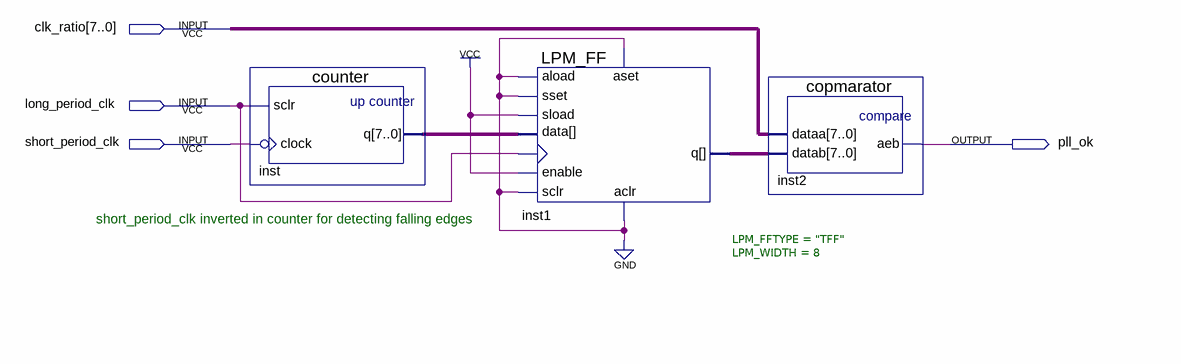
[diagram p0: schematic sheet]
// Quartus schematic PLL_TEST.bdf as structural Verilog: 3 symbols, 4 pins
module PLL_TEST (
  input  [7:0] clk_ratio,
  input  long_period_clk,
  input  short_period_clk,
  output pll_ok
);

  wire [7:0] inst1_q, inst_q;

  counter inst (.clock(~short_period_clk), .sclr(long_period_clk), .q(inst_q));
  LPM_FF #(.LPM_FFTYPE("TFF"), .LPM_WIDTH(8)) inst1 (
    .enable(1'b1), .clock(long_period_clk), .aload(1'b0), .sset(1'b0), .sload(1'b1), .aset(1'b0),
    .sclr(1'b0), .aclr(1'b0), .data(inst_q), .q(inst1_q));
  copmarator inst2 (.dataa(clk_ratio), .datab(inst1_q), .aeb(pll_ok));

  // Notes on the sheet:
  //   short_period_clk inverted in counter for detecting falling edges
endmodule
